# EAGLE design 1206 (EAGLE 7.7.0)
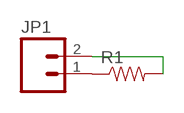
[diagram p0: schematic, sheet 1]

## Parts
JP1  M021X02_NO_SILK  [1X02_NO_SILK]
R1  RESISTOR1206  [1206]

## Nets
N$1: JP1.1 R1.1
N$2: JP1.2 R1.2

## Library data of the parts
JP1 = SparkFun-Connectors:M02: Standard 2-pin 0.1" header. Use with - straight break away headers ( PRT-00116) - right angle break away headers (PRT-00553) - swiss pins (PRT-00743) - machine pins (PRT-00117) - female headers (PRT-00115) Molex polarized connector foot print use with: PRT-08233 with associated crimp pins and housings. 2.54_SCREWTERM for use with PRT-10571. 3.5mm Screw Terminal footprints for PRT-08084 5mm Screw Terminal footprints for use with PRT-08432
R1 = SparkFun-Passives:RESISTOR: Resistor Basic schematic elements and footprints for 0603, 1206, and PTH resistors.

## Board
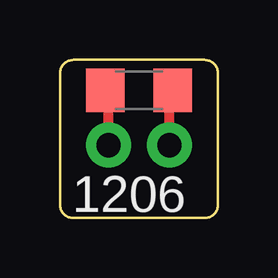
[diagram p1: board, top side]

Size 6.6 x 6.6 mm. Coordinates in mm from the lower left corner, seen from the top.
Outline: 6.6,6.04 6.6,0.57 arc-90 6.04,0 0.57,0 arc-90 0,0.57 0,6.04 arc-90 0.57,6.6 6.04,6.6 arc-90 6.6,6.04
Copper layers (1*16): Top 0.035mm / dielectric 1.5mm / Bottom 0.035mm
Design rules "default": minimum track width 10mil, minimum drill 24mil, track to track 8mil, track to pad 8mil, pad to pad 8mil, via to via 8mil, smd to smd 8mil, copper to edge 40mil, drill to drill 8mil, minimum pad ring 10mil, minimum via ring 8mil, stop-mask expansion 4mil, vias tented up to drill 0mil, thermal gap 10mil

### Footprints (pad centres in the part's own frame; a part is rotated, then mirrored left to right if it is on the bottom)
1X02_NO_SILK = drill 1.016 pad 1.88: 1 0,0; 2 2.54,0
1206 = smd 1.6 x 1.8: 1 -1.4,0; 2 1.4,0

### Placement (x,y rotation side)
JP1  2.03,3.05 0 top
R1  3.3,5.33 0 top

### Tracks (layer width: path | path; a pad name or v marks a point on that pad's centre or on a via)
N$1
  Top 0.406: JP1.1 2.03,5.17 R1.1
N$2
  Top 0.406: JP1.2 4.57,5.17 R1.2

### Text on the board
tPlace: 1206